# Altium schematic sheet CC2530_ADXL345.SchDoc: CC2530_ADXL345
size A; Revision: 1.0; SheetNumber: 4; SheetTotal: 6
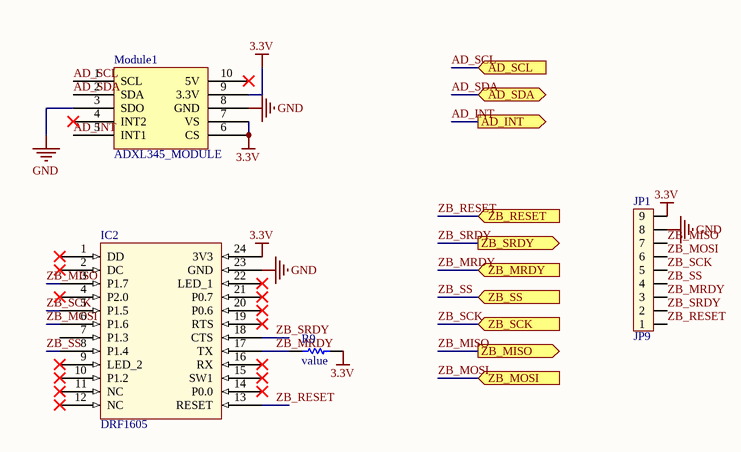
[diagram p0: CC2530_ADXL345.SchDoc]

## Parts
IC2  DRF1605  [DRF1605]
JP1  JP9  [JP9]
Module1  ADXL345_MODULE  [ADXL345_MODULE]
R9  value  [RES 0805]

## Ports
AD_INT (out), AD_SCL (in), AD_SDA (bidir), ZB_MISO (out), ZB_MOSI (in), ZB_MRDY (in), ZB_RESET (in), ZB_SCK (in), ZB_SRDY (out), ZB_SS (in)

## Nets
3.3V: IC2.24(3V3) JP1.9 Module1.6(CS) Module1.7(VS) Module1.9(3.3V) R9.1
GND: IC2.23(GND) JP1.8 Module1.3(SDO) Module1.8(GND)
AD_INT: Module1.5(INT1) ; port AD_INT
AD_SCL: Module1.1(SCL) ; port AD_SCL
AD_SDA: Module1.2(SDA) ; port AD_SDA
ZB_MISO: IC2.3(P1.7) JP1.7 ; port ZB_MISO
ZB_MOSI: IC2.6(P1.6) JP1.6 ; port ZB_MOSI
ZB_MRDY: IC2.17(TX) JP1.3 R9.2 ; port ZB_MRDY
ZB_RESET: IC2.13(RESET) JP1.1 ; port ZB_RESET
ZB_SCK: IC2.5(P1.5) JP1.5 ; port ZB_SCK
ZB_SRDY: IC2.18(CTS) JP1.2 ; port ZB_SRDY
ZB_SS: IC2.8(P1.4) JP1.4 ; port ZB_SS

Not connected (* = marked no-connect by the designer): IC2 1(DD)* 2(DC)* 4(P2.0)* 7(P1.3) 9(LED_2)* 10(P1.2)* 11(NC)* 12(NC)* 14(P0.0)* 15(SW1)* 16(RX)* 19(RTS)* 20(P0.6)* 21(P0.7)* 22(LED_1)*; Module1 4(INT2)* 10(5V)*

## Notes on the sheet
- Title
- Size:
- Date:
- A
- Number:
- Time:
- Revision:
- Sheet
- of
- File:

## Library data of the parts
R9 = Res_0805: resistor smd0805